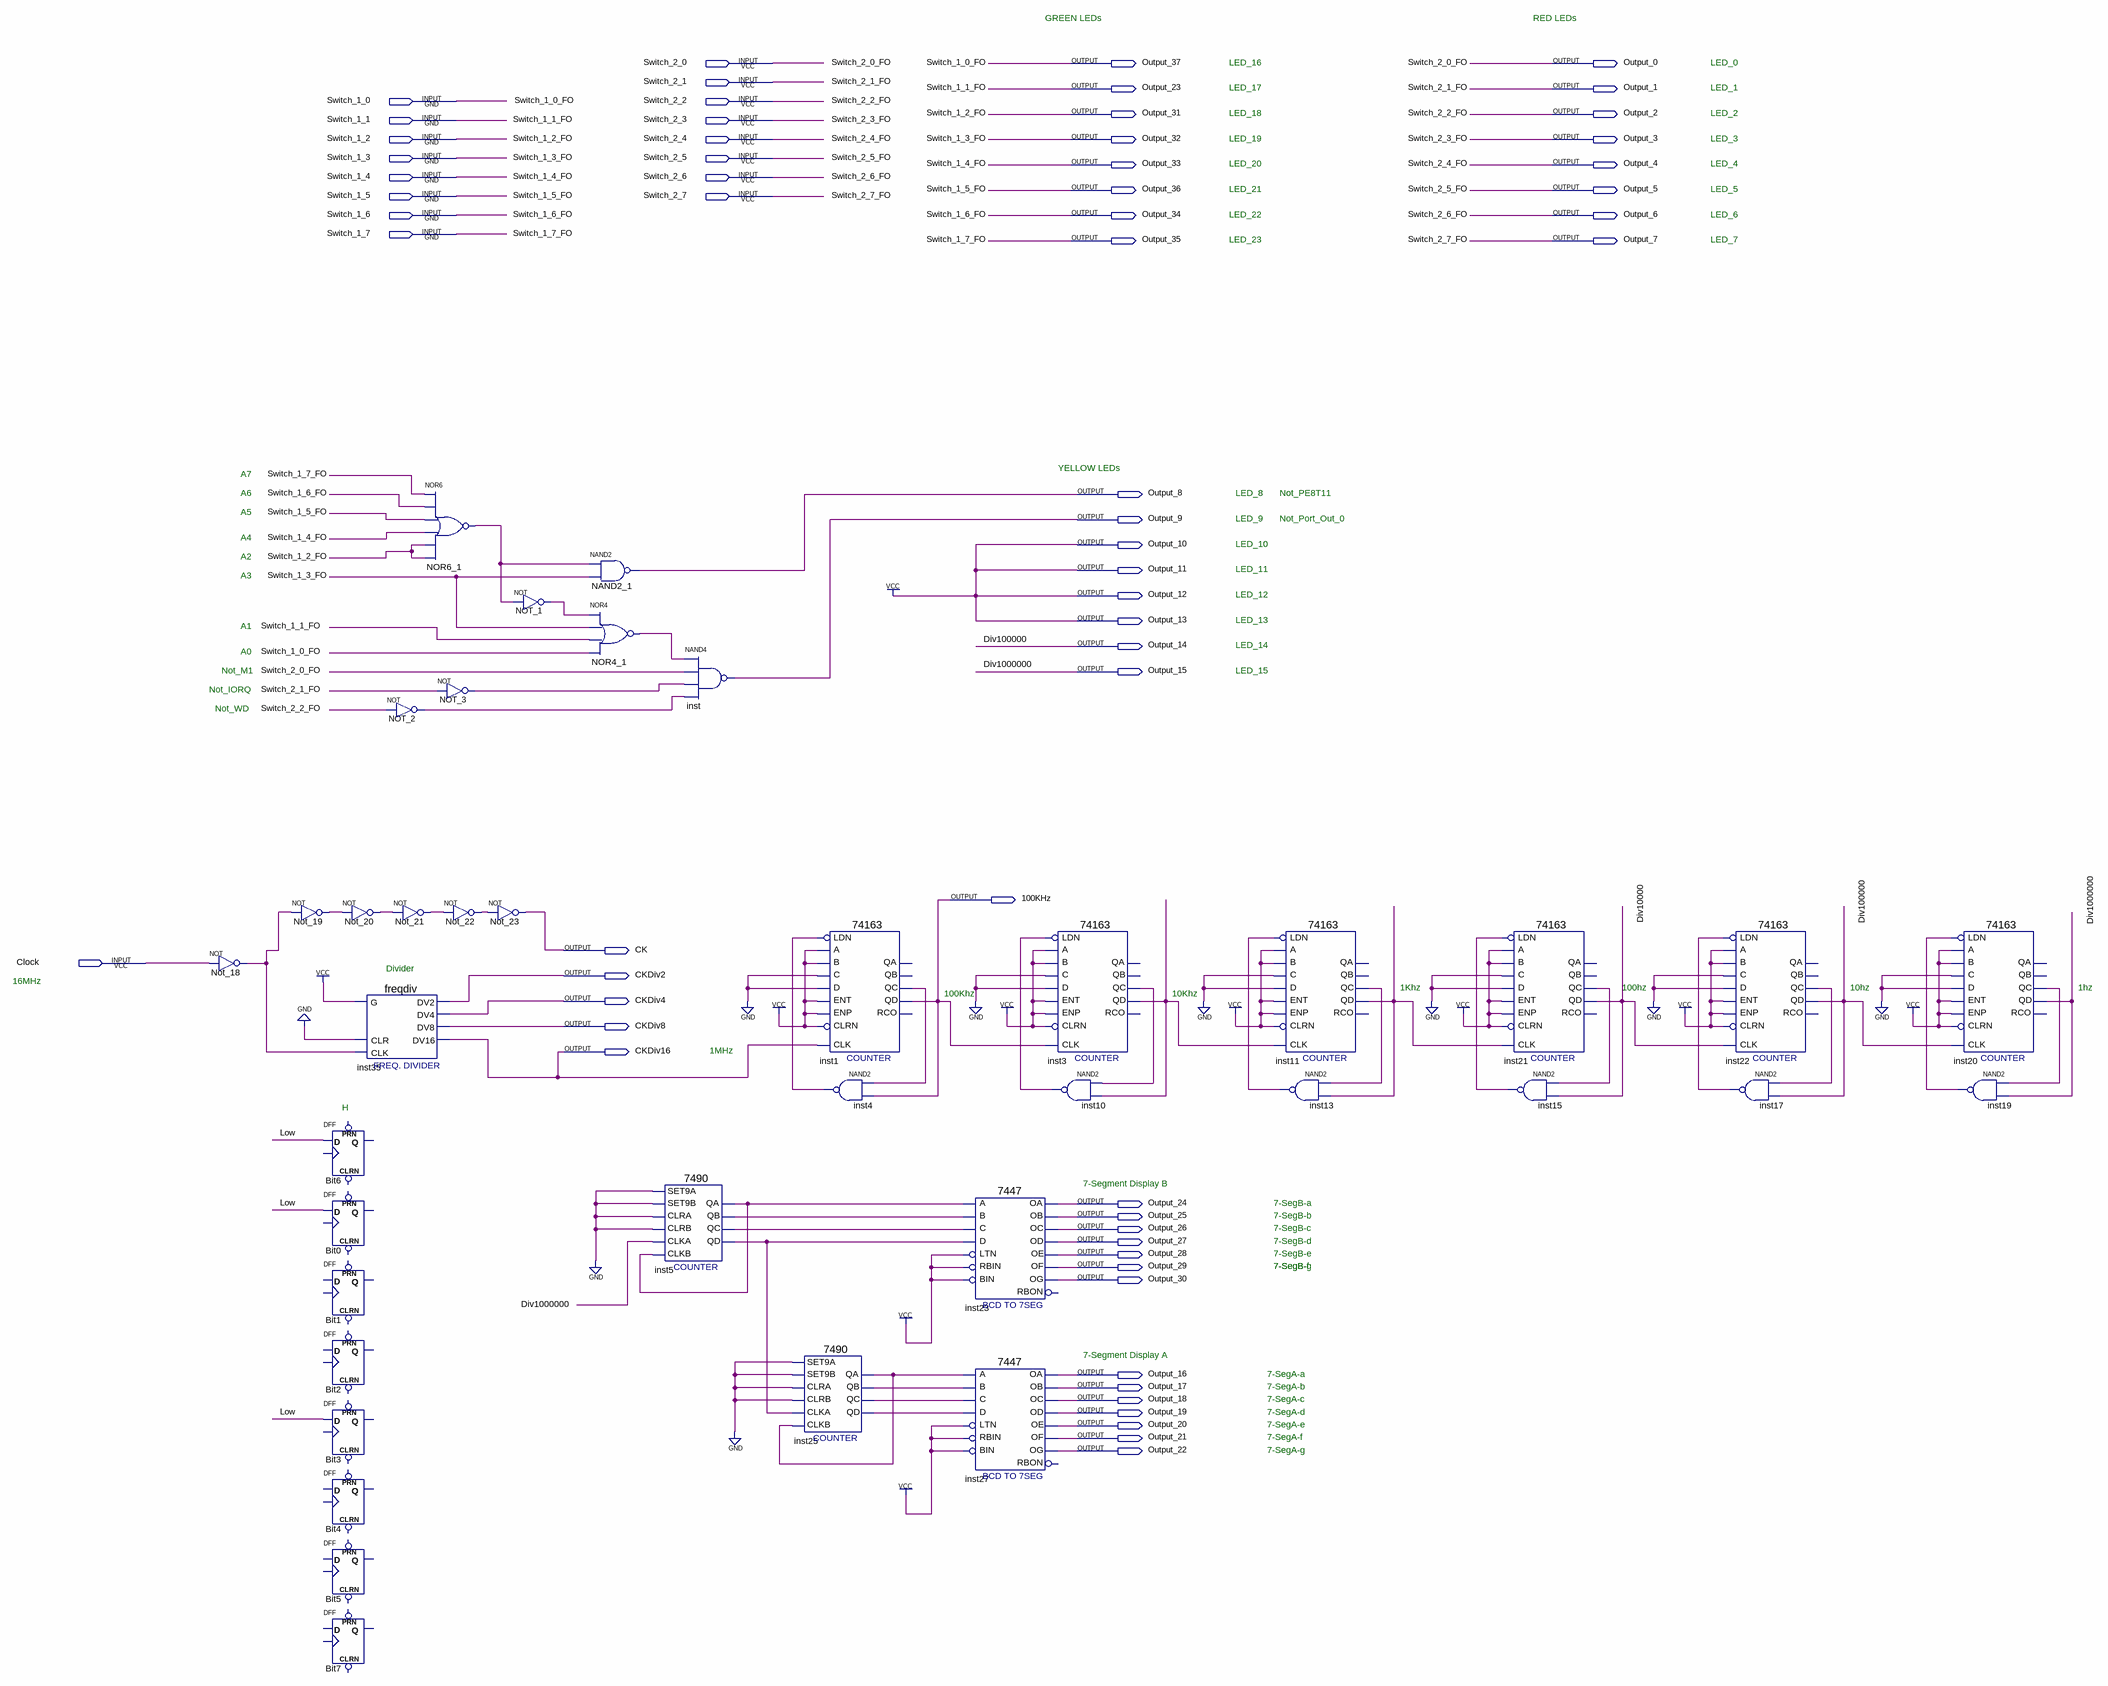
[diagram p0: schematic sheet]
// Quartus schematic TestBedt.bdf as structural Verilog: 38 symbols, 61 pins
module TestBedt (
  input  Switch_2_0,
  input  Switch_2_1,
  input  Switch_1_0,
  input  Switch_2_2,
  input  Switch_1_1,
  input  Switch_2_3,
  input  Switch_1_2,
  input  Switch_2_4,
  input  Switch_1_3,
  input  Switch_2_5,
  input  Switch_1_4,
  input  Switch_2_6,
  input  Switch_1_5,
  input  Switch_2_7,
  input  Switch_1_6,
  input  Switch_1_7,
  input  Clock,
  output Output_37,
  output Output_0,
  output Output_23,
  output Output_1,
  output Output_31,
  output Output_2,
  output Output_32,
  output Output_3,
  output Output_33,
  output Output_4,
  output Output_36,
  output Output_5,
  output Output_34,
  output Output_6,
  output Output_35,
  output Output_7,
  output Output_8,
  output Output_9,
  output Output_10,
  output Output_11,
  output Output_12,
  output Output_13,
  output Output_14,
  output Output_15,
  output \100KHz ,
  output CK,
  output CKDiv2,
  output CKDiv4,
  output CKDiv8,
  output CKDiv16,
  output Output_24,
  output Output_25,
  output Output_26,
  output Output_27,
  output Output_28,
  output Output_29,
  output Output_30,
  output Output_16,
  output Output_17,
  output Output_18,
  output Output_19,
  output Output_20,
  output Output_21,
  output Output_22
);

  wire Div10000, inst1_qc, inst3_qc, inst3_qd, inst4_out, inst5_qa, inst5_qb, inst5_qc, inst5_qd, inst10_out,
       inst11_qc, inst11_qd, inst13_out, inst15_out, inst17_out, inst19_out, inst20_qc, inst21_qc, inst22_qc,
       inst25_qa, inst25_qb, inst25_qc, inst25_qd, Low, NOR4_1_out, NOR6_1_out, NOT_1_out, NOT_2_out,
       NOT_3_out, Not_18_out, Not_19_out, Not_20_out, Not_21_out, Not_22_out;

  not Not_18 (Not_18_out, Clock);
  not Not_19 (Not_19_out, Not_18_out);
  not Not_20 (Not_20_out, Not_19_out);
  freqdiv inst35 (.CLK(Not_18_out), .CLR(1'b0), .G(1'b1), .DV2(CKDiv2), .DV4(CKDiv4), .DV8(CKDiv8), .DV16(CKDiv16));
  DFF Bit6 (.D(Low));  // open: CLRN, CLK, PRN, Q
  DFF Bit0 (.D(Low));  // open: CLRN, CLK, PRN, Q
  DFF Bit1 ();  // open: CLRN, CLK, D, PRN, Q
  DFF Bit2 ();  // open: CLRN, CLK, D, PRN, Q
  DFF Bit3 (.D(Low));  // open: CLRN, CLK, PRN, Q
  DFF Bit4 ();  // open: CLRN, CLK, D, PRN, Q
  DFF Bit5 ();  // open: CLRN, CLK, D, PRN, Q
  DFF Bit7 ();  // open: CLRN, CLK, D, PRN, Q
  not NOT_2 (NOT_2_out, Switch_2_2);
  not Not_21 (Not_21_out, Not_20_out);
  nor NOR6_1 (NOR6_1_out, Switch_1_7, Switch_1_6, Switch_1_5, Switch_1_4, Switch_1_2, Switch_1_2);
  not NOT_3 (NOT_3_out, Switch_2_1);
  not Not_22 (Not_22_out, Not_21_out);
  not Not_23 (CK, Not_22_out);
  not NOT_1 (NOT_1_out, NOR6_1_out);
  nand NAND2_1 (Output_8, NOR6_1_out, Switch_1_3);
  nor NOR4_1 (NOR4_1_out, NOT_1_out, Switch_1_3, Switch_1_1, Switch_1_0);
  \7490  inst5 (
    .SET9A(1'b0), .CLRA(1'b0), .SET9B(1'b0), .CLKB(inst5_qa), .CLKA(Output_15), .CLRB(1'b0), .QD(inst5_qd),
    .QA(inst5_qa), .QB(inst5_qb), .QC(inst5_qc));
  nand inst (Output_9, NOR4_1_out, Switch_2_0, NOT_3_out, NOT_2_out);
  \7490  inst25 (
    .SET9A(1'b0), .CLRA(1'b0), .SET9B(1'b0), .CLKB(inst25_qa), .CLKA(inst5_qd), .CLRB(1'b0), .QD(inst25_qd),
    .QA(inst25_qa), .QB(inst25_qb), .QC(inst25_qc));
  \74163  inst1 (
    .C(1'b0), .B(1'b1), .A(1'b1), .ENT(1'b1), .D(1'b0), .CLRN(1'b1), .CLK(CKDiv16), .ENP(1'b1),
    .LDN(inst4_out), .QC(inst1_qc), .QD(\100KHz ));  // open: QA, QB, RCO
  nand inst4 (inst4_out, inst1_qc, \100KHz );
  \7447  inst23 (
    .LTN(1'b1), .B(inst5_qb), .C(inst5_qc), .D(inst5_qd), .RBIN(1'b1), .BIN(1'b1), .A(inst5_qa),
    .OB(Output_25), .OC(Output_26), .OE(Output_28), .OD(Output_27), .OF(Output_29), .OG(Output_30),
    .OA(Output_24));  // open: RBON
  \7447  inst27 (
    .LTN(1'b1), .B(inst25_qb), .C(inst25_qc), .D(inst25_qd), .RBIN(1'b1), .BIN(1'b1), .A(inst25_qa),
    .OB(Output_17), .OC(Output_18), .OE(Output_20), .OD(Output_19), .OF(Output_21), .OG(Output_22),
    .OA(Output_16));  // open: RBON
  \74163  inst3 (
    .C(1'b0), .B(1'b1), .A(1'b1), .ENT(1'b1), .D(1'b0), .CLRN(1'b1), .CLK(\100KHz ), .ENP(1'b1),
    .LDN(inst10_out), .QC(inst3_qc), .QD(inst3_qd));  // open: QA, QB, RCO
  nand inst10 (inst10_out, inst3_qc, inst3_qd);
  \74163  inst11 (
    .C(1'b0), .B(1'b1), .A(1'b1), .ENT(1'b1), .D(1'b0), .CLRN(1'b1), .CLK(inst3_qd), .ENP(1'b1),
    .LDN(inst13_out), .QC(inst11_qc), .QD(inst11_qd));  // open: QA, QB, RCO
  nand inst13 (inst13_out, inst11_qc, inst11_qd);
  \74163  inst21 (
    .C(1'b0), .B(1'b1), .A(1'b1), .ENT(1'b1), .D(1'b0), .CLRN(1'b1), .CLK(inst11_qd), .ENP(1'b1),
    .LDN(inst15_out), .QC(inst21_qc), .QD(Div10000));  // open: QA, QB, RCO
  nand inst15 (inst15_out, inst21_qc, Div10000);
  \74163  inst22 (
    .C(1'b0), .B(1'b1), .A(1'b1), .ENT(1'b1), .D(1'b0), .CLRN(1'b1), .CLK(Div10000), .ENP(1'b1),
    .LDN(inst17_out), .QC(inst22_qc), .QD(Output_14));  // open: QA, QB, RCO
  nand inst17 (inst17_out, inst22_qc, Output_14);
  \74163  inst20 (
    .C(1'b0), .B(1'b1), .A(1'b1), .ENT(1'b1), .D(1'b0), .CLRN(1'b1), .CLK(Output_14), .ENP(1'b1),
    .LDN(inst19_out), .QC(inst20_qc), .QD(Output_15));  // open: QA, QB, RCO
  nand inst19 (inst19_out, inst20_qc, Output_15);

  assign Output_0 = Switch_2_0;
  assign Output_1 = Switch_2_1;
  assign Output_2 = Switch_2_2;
  assign Output_3 = Switch_2_3;
  assign Output_4 = Switch_2_4;
  assign Output_5 = Switch_2_5;
  assign Output_6 = Switch_2_6;
  assign Output_7 = Switch_2_7;
  assign Output_10 = 1'b1;
  assign Output_11 = 1'b1;
  assign Output_12 = 1'b1;
  assign Output_13 = 1'b1;
  assign Output_23 = Switch_1_1;
  assign Output_31 = Switch_1_2;
  assign Output_32 = Switch_1_3;
  assign Output_33 = Switch_1_4;
  assign Output_34 = Switch_1_6;
  assign Output_35 = Switch_1_7;
  assign Output_36 = Switch_1_5;
  assign Output_37 = Switch_1_0;

  // Other names for the same wires on the sheet: Div100000 = Output_14; Div1000000 = Output_15;
  //   Switch_1_0_FO = Switch_1_0; Switch_1_1_FO = Switch_1_1; Switch_1_2_FO = Switch_1_2; Switch_1_3_FO = Switch_1_3;
  //   Switch_1_4_FO = Switch_1_4; Switch_1_5_FO = Switch_1_5; Switch_1_6_FO = Switch_1_6; Switch_1_7_FO = Switch_1_7;
  //   Switch_2_0_FO = Switch_2_0; Switch_2_1_FO = Switch_2_1; Switch_2_2_FO = Switch_2_2; Switch_2_3_FO = Switch_2_3;
  //   Switch_2_4_FO = Switch_2_4; Switch_2_5_FO = Switch_2_5; Switch_2_6_FO = Switch_2_6; Switch_2_7_FO = Switch_2_7

  // Notes on the sheet:
  //   GREEN LEDs
  //   RED LEDs
  //   LED_16
  //   LED_0
  //   LED_17
  //   LED_1
  //   LED_18
  //   LED_2
  //   LED_19
  //   LED_3
  //   LED_20
  //   LED_4
  //   LED_21
  //   LED_5
  //   LED_22
  //   LED_6
  //   LED_23
  //   LED_7
  //   YELLOW LEDs
  //   A7
  //   A6
  //   LED_8
  //   Not_PE8T11
  //   A5
  //   LED_9
  //   Not_Port_Out_0
  //   A4
  //   LED_10
  //   A2
  //   LED_11
  //   A3
  //   LED_12
  //   LED_13
  //   A1
  //   LED_14
  //   A0
  //   Not_M1
  //   LED_15
  //   Not_IORQ
  //   Not_WD
  //   Divider
  //   16MHz
  //   1Khz
  //   100hz
  //   10hz
  //   1hz
  //   100Khz
  //   10Khz
  //   1MHz
  //   H
  //   7-Segment Display B
  //   7-SegB-a
  //   7-SegB-b
  //   7-SegB-c
  //   7-SegB-d
  //   7-SegB-e
  //   7-SegB-f
  //   7-SegB-g
  //   7-Segment Display A
  //   7-SegA-a
  //   7-SegA-b
  //   7-SegA-c
  //   7-SegA-d
  //   7-SegA-e
  //   7-SegA-f
  //   7-SegA-g
endmodule
